# Altium schematic sheet Relay.SchDoc
size A3; SheetNumber: 12; SheetTotal: 12
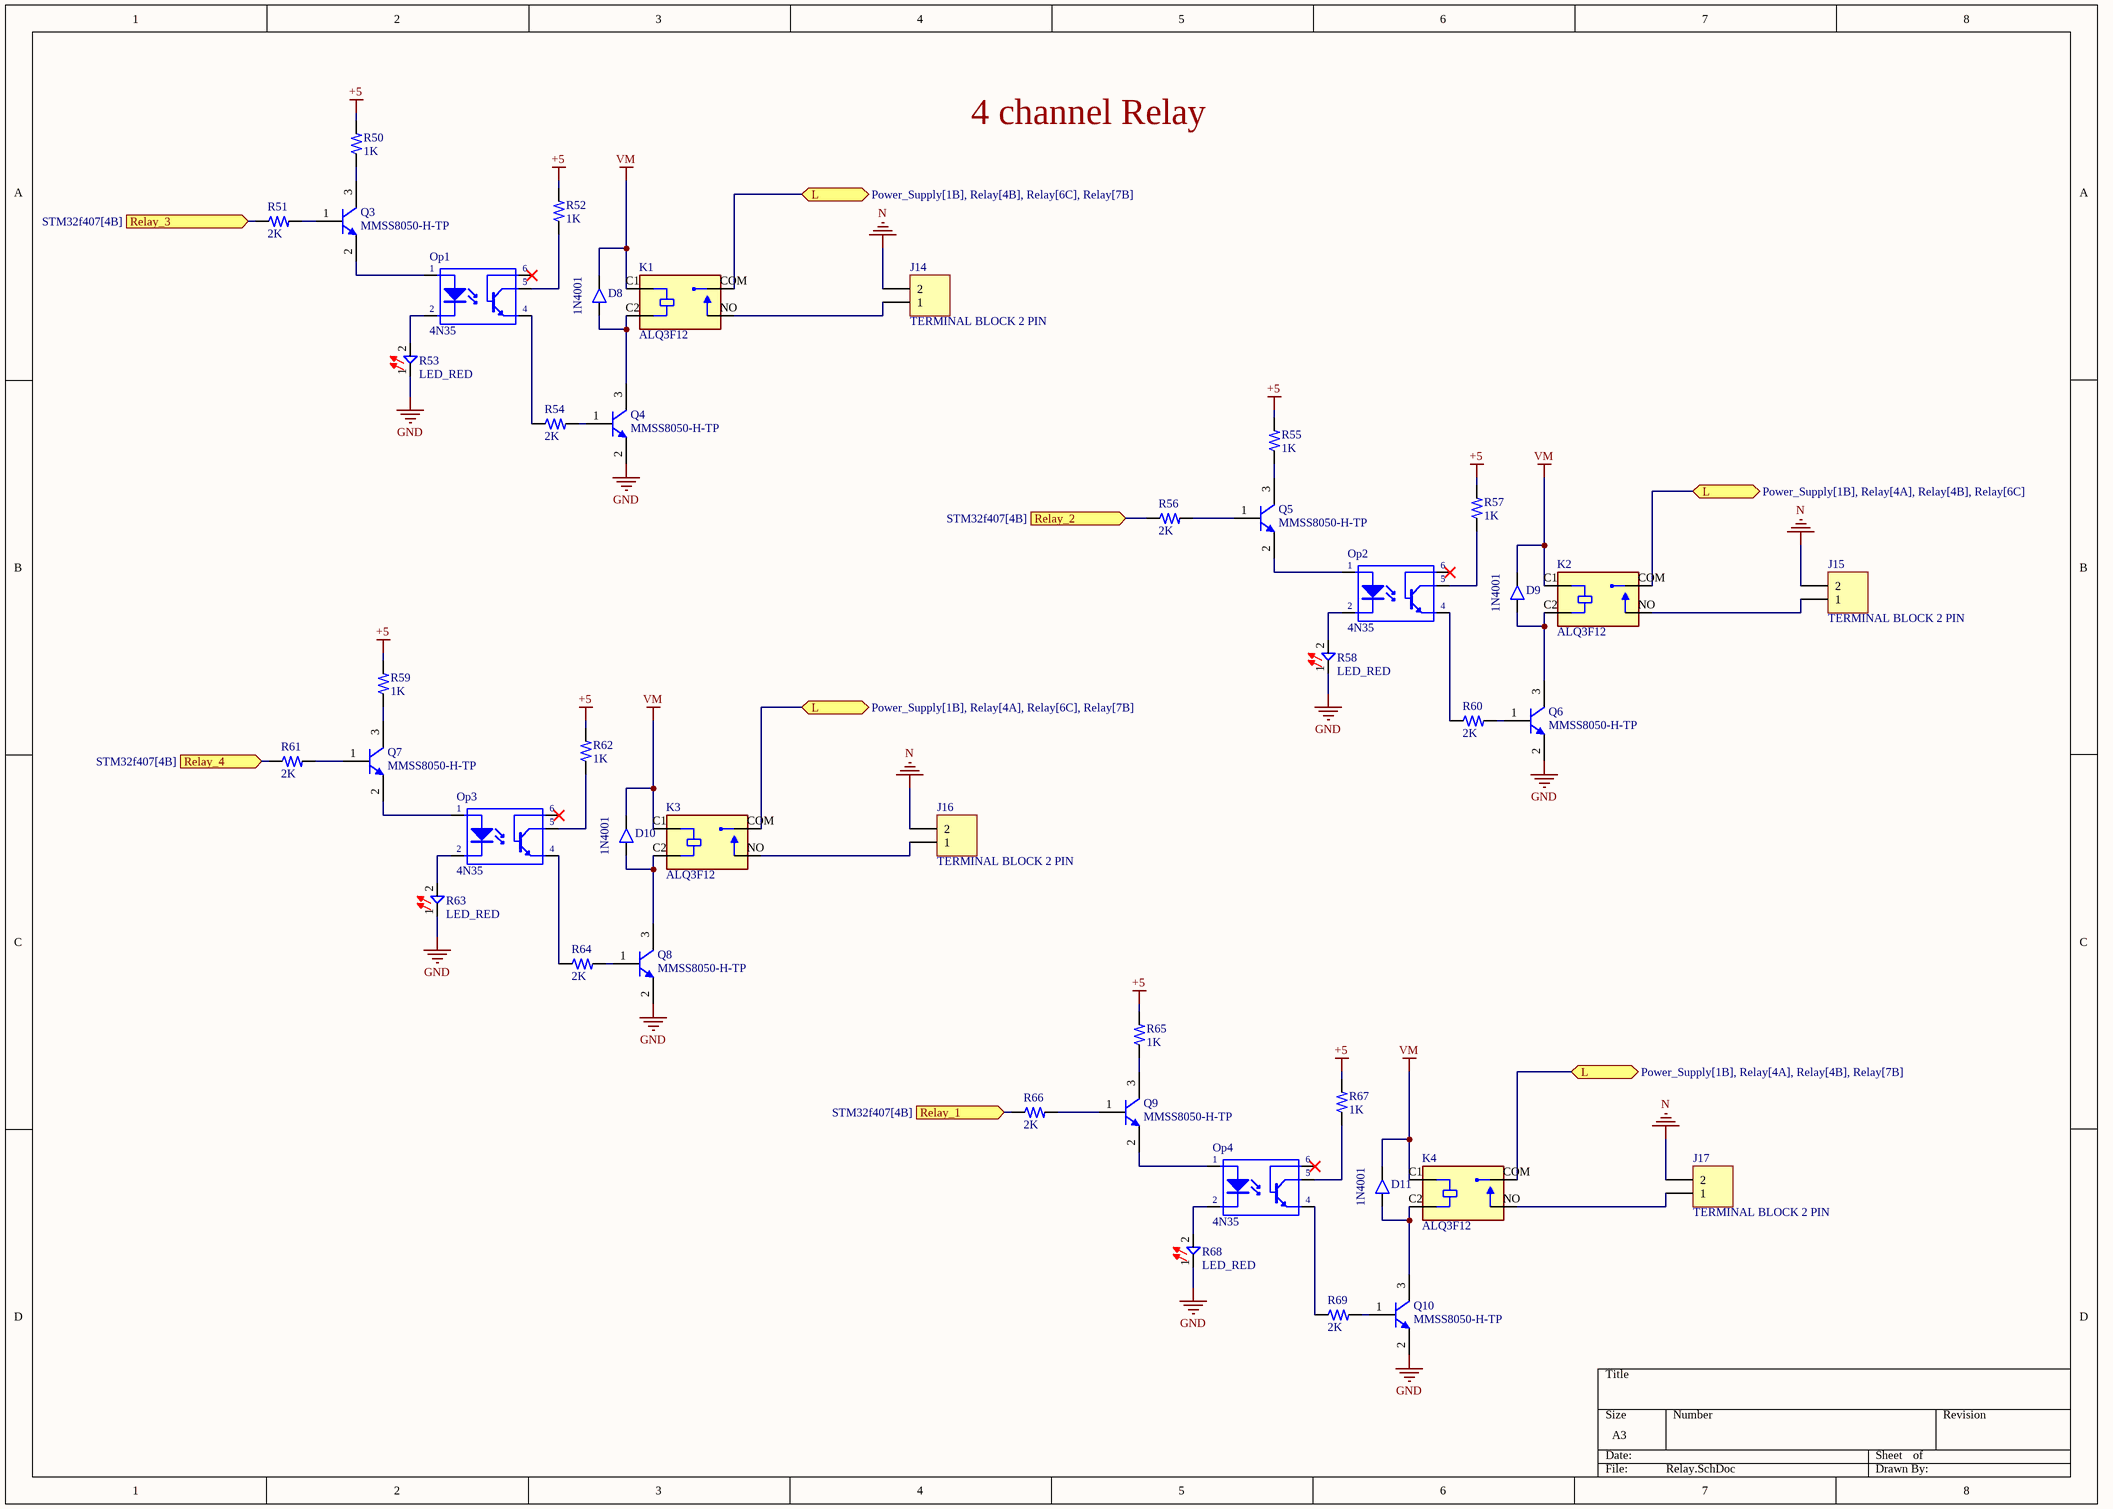
[diagram p0: Relay.SchDoc]

## Parts
D8  1N4001  [1N4001]
D9  1N4001  [1N4001]
D10  1N4001  [1N4001]
D11  1N4001  [1N4001]
J14  TERMINAL BLOCK 2 PIN  [CON2_P196_1729128_TH_ST]
J15  TERMINAL BLOCK 2 PIN  [CON2_P196_1729128_TH_ST]
J16  TERMINAL BLOCK 2 PIN  [CON2_P196_1729128_TH_ST]
J17  TERMINAL BLOCK 2 PIN  [CON2_P196_1729128_TH_ST]
K1  ALQ3F12  [Relay_ALQ3F12]
K2  ALQ3F12  [Relay_ALQ3F12]
K3  ALQ3F12  [Relay_ALQ3F12]
K4  ALQ3F12  [Relay_ALQ3F12]
Op1  4N35  [DIP6_100_300_78X45_TH]
Op2  4N35  [DIP6_100_300_78X45_TH]
Op3  4N35  [DIP6_100_300_78X45_TH]
Op4  4N35  [DIP6_100_300_78X45_TH]
Q3  MMSS8050-H-TP  [SOT_23_3]
Q4  MMSS8050-H-TP  [SOT_23_3]
Q5  MMSS8050-H-TP  [SOT_23_3]
Q6  MMSS8050-H-TP  [SOT_23_3]
Q7  MMSS8050-H-TP  [SOT_23_3]
Q8  MMSS8050-H-TP  [SOT_23_3]
Q9  MMSS8050-H-TP  [SOT_23_3]
Q10  MMSS8050-H-TP  [SOT_23_3]
R50  1K  [Resistor_0603]
R51  2K  [Resistor_0603]
R52  1K  [Resistor_0603]
R53  LED_RED  [LTST-C171KRKT]
R54  2K  [Resistor_0603]
R55  1K  [Resistor_0603]
R56  2K  [Resistor_0603]
R57  1K  [Resistor_0603]
R58  LED_RED  [LTST-C171KRKT]
R59  1K  [Resistor_0603]
R60  2K  [Resistor_0603]
R61  2K  [Resistor_0603]
R62  1K  [Resistor_0603]
R63  LED_RED  [LTST-C171KRKT]
R64  2K  [Resistor_0603]
R65  1K  [Resistor_0603]
R66  2K  [Resistor_0603]
R67  1K  [Resistor_0603]
R68  LED_RED  [LTST-C171KRKT]
R69  2K  [Resistor_0603]

## Ports
L (bidir, see Power_Supply[1B], Relay[4A], Relay[4B], Relay[6C]), L (bidir, see Power_Supply[1B], Relay[4A], Relay[4B], Relay[7B]), L (bidir, see Power_Supply[1B], Relay[4A], Relay[6C], Relay[7B]), L (bidir, see Power_Supply[1B], Relay[4B], Relay[6C], Relay[7B]), Relay_1 (in, see STM32f407[4B]), Relay_2 (in, see STM32f407[4B]), Relay_3 (in, see STM32f407[4B]), Relay_4 (in, see STM32f407[4B])

## Nets
+5: R50.2 R52.2 R55.2 R57.2 R59.2 R62.2 R65.2 R67.2
GND: Q4.2(E) Q6.2(E) Q8.2(E) Q10.2(E) R53.1 R58.1 R63.1 R68.1
N: J14.2 J15.2 J16.2 J17.2
VM: D8.C(CATHODE) D9.C(CATHODE) D10.C(CATHODE) D11.C(CATHODE) K1.C1(COIL1) K2.C1(COIL1) K3.C1(COIL1) K4.C1(COIL1)
L: K1.COM K2.COM K3.COM K4.COM ; port L
Relay_1: R66.1 ; port Relay_1
Relay_2: R56.1 ; port Relay_2
Relay_3: R51.1 ; port Relay_3
Relay_4: R61.1 ; port Relay_4
NetD8_A: D8.A(ANODE) K1.C2(COIL2) Q4.3(C)
NetD9_A: D9.A(ANODE) K2.C2(COIL2) Q6.3(C)
NetD10_A: D10.A(ANODE) K3.C2(COIL2) Q8.3(C)
NetD11_A: D11.A(ANODE) K4.C2(COIL2) Q10.3(C)
NetJ14_1: J14.1 K1.NO
NetJ15_1: J15.1 K2.NO
NetJ16_1: J16.1 K3.NO
NetJ17_1: J17.1 K4.NO
NetOp1_1: Op1.1(A) Q3.2(E)
NetOp1_2: Op1.2(K) R53.2
NetOp1_4: Op1.4(E) R54.1
NetOp1_5: Op1.5(C) R52.1
NetOp2_1: Op2.1(A) Q5.2(E)
NetOp2_2: Op2.2(K) R58.2
NetOp2_4: Op2.4(E) R60.1
NetOp2_5: Op2.5(C) R57.1
NetOp3_1: Op3.1(A) Q7.2(E)
NetOp3_2: Op3.2(K) R63.2
NetOp3_4: Op3.4(E) R64.1
NetOp3_5: Op3.5(C) R62.1
NetOp4_1: Op4.1(A) Q9.2(E)
NetOp4_2: Op4.2(K) R68.2
NetOp4_4: Op4.4(E) R69.1
NetOp4_5: Op4.5(C) R67.1
NetQ3_1: Q3.1(B) R51.2
NetQ3_3: Q3.3(C) R50.1
NetQ4_1: Q4.1(B) R54.2
NetQ5_1: Q5.1(B) R56.2
NetQ5_3: Q5.3(C) R55.1
NetQ6_1: Q6.1(B) R60.2
NetQ7_1: Q7.1(B) R61.2
NetQ7_3: Q7.3(C) R59.1
NetQ8_1: Q8.1(B) R64.2
NetQ9_1: Q9.1(B) R66.2
NetQ9_3: Q9.3(C) R65.1
NetQ10_1: Q10.1(B) R69.2

Not connected (* = marked no-connect by the designer): Op1 6(C)*; Op2 6(C)*; Op3 6(C)*; Op4 6(C)*

## Notes on the sheet
- 4 channel Relay

## Library data of the parts
D8-D11 = Diode_1N4001RLG: 1N4001 Series 1 A 50 V Axial Lead Standard Recovery Rectifier - CASE 59-10; Manufacturer: ON Semiconductor; Supplier: Avnet; Supplier Part Number: 09R9749; Manufacturer Part Number: 1N4001RLG; RoHS: Yes; Category: Rectifier Diodes; Stock: 6710; Pricing: 1=0,055, 25=0,182, 50=0,135, 100=0,089, 250=0,077 (USD)
J14-J17 = CON-TB_2X1-196-ST-TH: 2 Pins, 1 Row 5mm Pitch, straight Connector, male; Manufacturer: Phoenix Contact; Manufacturer Part Number: MKDSN1,5/2; Alternate Part Number-1: NA; Case/Package: TH-CON; Supplier-1: SP ROAD; Supplier Part Number-1: MKDSN1,5/2
K1-K4 = Relay_12V_10A: RELAY GEN PURPOSE SPST 10A 12V; Manufacturer: Panasonic; Coil Current: 16.7mA; Operate Time: 20ms; Coil Power: 200mW; Coil Resistance: 720R; Relay Type: General Purpose; Coil Type: Non-Latching; Supplier: Mouser; Supplier Part Number: 667-ALQ3F12; Manufacturer Part Number: ALQ3F12; RoHS: Yes; Category: Power Relays; Stock: 125; Pricing: 1=1,74, 10=1,6, 50=1,48, 100=1,26, 1000=0,787, 10000=0,726 (USD); Mounting Technology: Through Hole; Contact Material: Silver; Min Operating Temperature: -40°C; Max Operating Temperature: 85°C; Package Quantity: 100; Packaging: Box; Throw Configuration: SPST; Release Time: 20ms; Termination: PC Pin; Coil Voltage (DC): 12V; Contact Current Rating: 10A; Series: ALQ; Lead Free: Lead Free; RoHS Compliant: Yes; ComponentLink1URL: https://media.digikey.com/pdf/Data%20Sheets/Panasonic%20Electric%20Works%20PDFs/ALQ(LQ)Relays_NewProdIntro.pdf?src-supplier=Digikey; ComponentLink1Description: https://media.digikey.com/pdf/Data%20Sheets/Panasonic%20Electric%20Works%20PDFs/ALQ(LQ)Relays_NewProdIntro.pdf?src-supplier=Digikey; ComponentLink2URL: https://datasheet.octopart.com/ALQ3F12-Panasonic-datasheet-78834688.pdf?src-supplier=Farnell; ComponentLink2Description: https://datasheet.octopart.com/ALQ3F12-Panasonic-datasheet-78834688.pdf?src-supplier=Farnell; ComponentLink3URL: https://datasheet.octopart.com/ALQ3F12-Panasonic-datasheet-45185651.pdf?src-supplier=Future+Electronics; ComponentLink3Description: https://datasheet.octopart.com/ALQ3F12-Panasonic-datasheet-45185651.pdf?src-supplier=Future+Electronics; ComponentLink4URL: http://www.farnell.com/datasheets/2245159.pdf?src-supplier=Newark; ComponentLink4Description: http://www.farnell.com/datasheets/2245159.pdf?src-supplier=Newark; ComponentLink5URL: http://www3.panasonic.biz/ac/e_download/control/relay/power/catalog/mech_eng_lq.pdf?src-supplier=Digikey; ComponentLink5Description: http://www3.panasonic.biz/ac/e_download/control/relay/power/catalog/mech_eng_lq.pdf?src-supplier=Digikey; ComponentLink6URL: https://datasheet.octopart.com/ALQ3F12-Panasonic-datasheet-151511680.pdf?src-supplier=Master+Electronics; ComponentLink6Description: https://datasheet.octopart.com/ALQ3F12-Panasonic-datasheet-151511680.pdf?src-supplier=Master+Electronics
Op1-Op4 = OPTO_1CH-5KV-50mA-DIP6: Power Field-Effect Transistor, 14.5A, 30V, 0.0055ohm, 1-Element, N-Channel, MOSFET; Manufacturer: ON Semiconductor; Manufacturer Part Number: NTD4804N-35G; Supplier: Farnell; Supplier Part Number: 1453644; RoHS: Yes; Category: MOSFETs; Pricing: 1=1,73, 25=1,13, 100=0,89, 250=0,72, 1000=0,57 (GBP); ComponentLink1URL: https://datasheet.ciiva.com/8059/86019-8059353.pdf?src-supplier=Element14; ComponentLink1Description: https://datasheet.ciiva.com/8059/86019-8059353.pdf?src-supplier=Element14; ComponentLink2URL: https://datasheet.ciiva.com/947/ntd4804n-d-947681.pdf?src-supplier=Digikey; ComponentLink2Description: https://datasheet.ciiva.com/947/ntd4804n-d-947681.pdf?src-supplier=Digikey
Q3-Q10 = TRNS-NPN_25V-1.5A-SOT23: Bipolar (BJT) Transistor NPN 25V 1.5A 100MHz 625mW Surface Mount SOT-23; Manufacturer: MCC; Alternate Part Number-1: NA; Manufacturer Part Number: MMSS8050-H-TP; Case/Package: SOT-23; Supplier-1: MOUSER; Supplier Part Number-1: MMSS8050-H-TP
R50 R52 R55 R57 R59 R62 R65 R67 = R_1k_0603: Res Thick Film 0603 1K Ohm 1% 0.1W(1/10W) ±100ppm/C Pad SMD T/R; Manufacturer: Walsin Technologies; Manufacturer Part Number: WR06X1001FTL; Power Rating: 100mW; Temperature Coefficient: 100ppm/°C; Voltage Rating (DC): 75V; Value: 1kR; Voltage Rating: 50V; Supplier: Digikey; Supplier Part Number: 1292-WR06X1001FTLCT-ND; RoHS: Yes; Category: Chip SMD Resistors; Stock: 17; Pricing: 1=0,1, 10=0,015, 50=0,0086, 100=0,0068, 500=0,00418, 1000=0,00345 (USD); Mounting Technology: Surface Mount; Case/Package: 0603; Case Code (Imperial): 0603; Case Code (Metric): 1608; Contact Material: 154ConductorMaterial; Min Operating Temperature: -55°C; Max Operating Temperature: 155°C; Packaging: Tape and Reel; Tolerance: 1%; Resistor Type: Thick Film; Resistance Tolerance: 1%; Package Quantity: 5000; Termination: SMD/SMT; Series: WR06X; Construction: Rectangular; Length: 1.6mm; Width: 0.8mm; Height: 0.45mm; Depth: 0.8mm; RoHS Compliant: Yes; Reach SVHC Compliant: Unknown; Lead Free: 5697LeadFree; Military Standard: Not; ComponentLink1URL: https://datasheet.ciiva.com/26946/getdatasheetpartid-137128-26946327.pdf?src-supplier=Verical; ComponentLink1Description: https://datasheet.ciiva.com/26946/getdatasheetpartid-137128-26946327.pdf?src-supplier=Verical
R51 R54 R56 R60 R61 R64 R66 R69 = R_2k_0603: Res Thin Film 0603 2K Ohm 1% 0.125W(1/8W) ±100ppm/C Sulfur Resistant Pad SMD T/R; Manufacturer: Stackpole Electronics; Manufacturer Part Number: RNCP0603FTD2K00; Value: 2kR; Max Power Dissipation: 125mW; Temperature Coefficient: 100ppm/°C; Voltage Rating: 150V; Supplier: Digikey; Supplier Part Number: RNCP0603FTD2K00CT-ND; RoHS: Yes; Category: Chip SMD Resistors; Stock: 64735; Pricing: 1=0,1, 10=0,012, 50=0,0108, 100=0,0106, 500=0,00848 (USD); Mounting Technology: Surface Mount; Case/Package: 0603; Case Code (Metric): 1608; Case Code (Imperial): 0603; Min Operating Temperature: -55°C; Max Operating Temperature: 155°C; Tolerance: 1%; Packaging: Cut Tape; Number of Terminations: 2; Features: Moisture Resistant,Anti-Sulfur; Series: RNCP; Length: 0.059inch; Width: 0.031inch; Height: 0.02inch; Lead Free: Lead Free; RoHS Compliant: Yes; ComponentLink1URL: https://www.seielect.com/catalog/SEI-Packaging.pdf?src-supplier=Digikey; ComponentLink1Description: https://www.seielect.com/catalog/SEI-Packaging.pdf?src-supplier=Digikey
R53 R58 R63 R68 = LED_RED_SMD: OPTOELECTRONICS - SMD Chip LED - TopView Single Color Chip LED, Red, 631 at 20mA, 18 to approx. 180 at 20mA; Manufacturer: Vishay Lite-On; Wavelength: 631nm; Supplier: Digikey; Supplier Part Number: 160-1427-1-ND; Manufacturer Part Number: LTST-C171KRKT; RoHS: Yes; Category: LEDs; Stock: 98881; Pricing: 1=0,15, 10=0,105, 100=0,0723, 500=0,05736, 1000=0,05238 (USD); Lead Free: 5697LeadFree; ComponentLink1URL: https://datasheet.ciiva.com/11775/0900766b80dc0299-11775643.pdf?src-supplier=Rs; ComponentLink1Description: https://datasheet.ciiva.com/11775/0900766b80dc0299-11775643.pdf?src-supplier=Rs; ComponentLink2URL: https://datasheet.ciiva.com/12403/lite-on-ltst-c171krkt-187201-12403781.pdf?src-supplier=Mouser; ComponentLink2Description: https://datasheet.ciiva.com/12403/lite-on-ltst-c171krkt-187201-12403781.pdf?src-supplier=Mouser; ComponentLink3URL: https://datasheet.ciiva.com/16444/lite-on20ltst-c171krkt-16444779.pdf?src-supplier=Future+Electronics; ComponentLink3Description: https://datasheet.ciiva.com/16444/lite-on20ltst-c171krkt-16444779.pdf?src-supplier=Future+Electronics; ComponentLink4URL: https://datasheet.ciiva.com/2110/s-110-ltst-c171krkt-2110066.pdf?src-supplier=Digikey; ComponentLink4Description: https://datasheet.ciiva.com/2110/s-110-ltst-c171krkt-2110066.pdf?src-supplier=Digikey; ComponentLink5URL: https://datasheet.ciiva.com/2110/s-110-ltst-c171krkt-2110067.pdf?src-supplier=Digikey; ComponentLink5Description: https://datasheet.ciiva.com/2110/s-110-ltst-c171krkt-2110067.pdf?src-supplier=Digikey; ComponentLink6URL: https://datasheet.ciiva.com/2110/s-110-ltst-c171krkt-2110068.pdf?src-supplier=Digikey; ComponentLink6Description: https://datasheet.ciiva.com/2110/s-110-ltst-c171krkt-2110068.pdf?src-supplier=Digikey